# Altium schematic sheet Y9A_4_5050.SchDoc
size A4
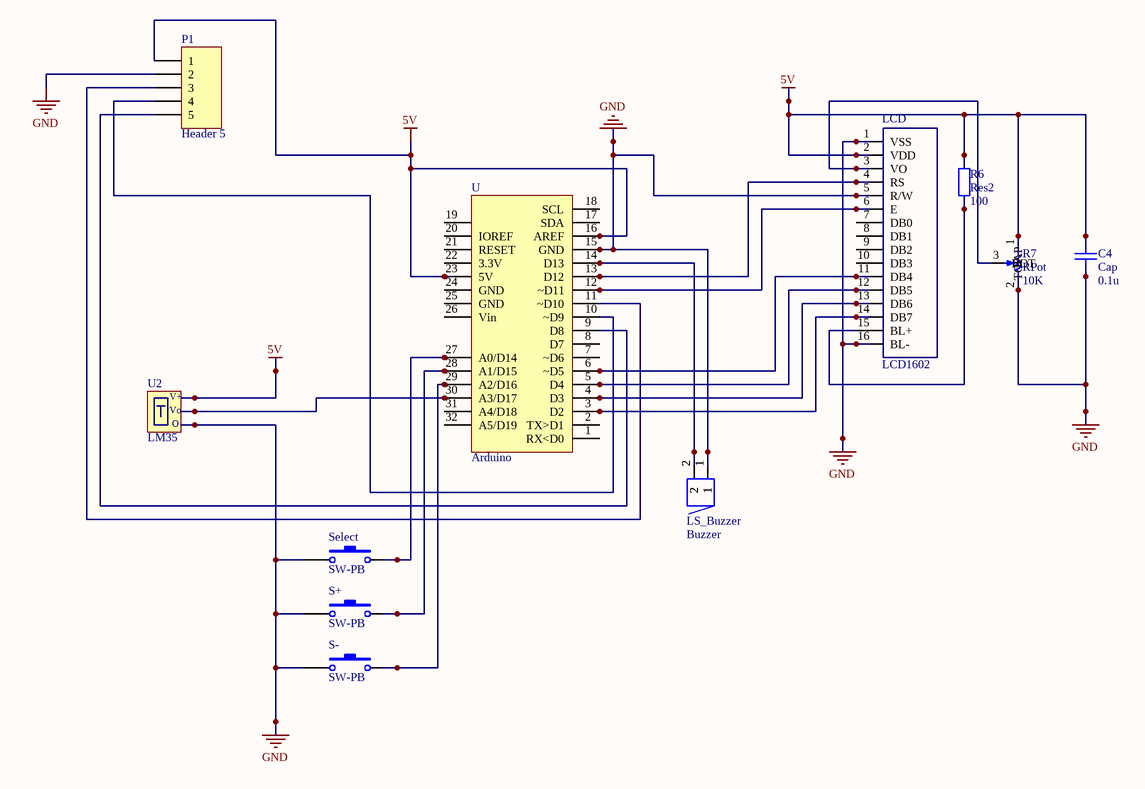
[diagram p0: Y9A_4_5050.SchDoc]

## Parts
C4  Cap  value 0.1u  [RAD-0.3]
LCD  LCD1602  [LCD1602]
LS_Buzzer  Buzzer  [Buzzer]
P1  Header 5  [HDR1X5]
R6  Res2  value 100  [AXIAL-0.4]
R7  RPot  value 10K  [RP-W]
S+  SW-PB  [AN-S]
S-  SW-PB  [AN-S]
Select  SW-PB  [AN-S]
U  Arduino  [Arduino-UNO-EX]
U2  LM35  [LM35]

## Nets
5V: C4.2 LCD.2(VDD) P1.1 R6.2 R7.1(TOP) U.16(AREF) U.23(5V) U2.1
GND: C4.1 LCD.1(VSS) LCD.5(R/W) LCD.16(BL-) LS_Buzzer.1 P1.2 R7.2(TAP) S+.1 S-.1 Select.1 U.15(GND) U2.3
NetLCD_3: LCD.3(VO) R7.3(BOT)
NetLCD_4: LCD.4(RS) U.13(D12)
NetLCD_6: LCD.6(E) U.12(~D11)
NetLCD_11: LCD.11(DB4) U.6(~D5)
NetLCD_12: LCD.12(DB5) U.5(D4)
NetLCD_13: LCD.13(DB6) U.4(D3)
NetLCD_14: LCD.14(DB7) U.3(D2)
NetLCD_15: LCD.15(BL+) R6.1
NetLS_Buzzer_2: LS_Buzzer.2 U.14(D13)
NetP1_3: P1.3 U.11(~D10)
NetP1_4: P1.4 U.10(~D9)
NetP1_5: P1.5 U.9(D8)
NetS+_2: S+.2 U.28(A1/D15)
NetS-_2: S-.2 U.29(A2/D16)
NetSelect_2: Select.2 U.27(A0/D14)
NetU_30: U.30(A3/D17) U2.2

Not connected (* = marked no-connect by the designer): LCD 7(DB0) 8(DB1) 9(DB2) 10(DB3); U 1(RX<D0) 2(TX>D1) 7(~D6) 8(D7) 17(SDA) 18(SCL) 19 20(IOREF) 21(RESET) 22(3.3V) 24(GND) 25(GND) 26(Vin) 31(A4/D18) 32(A5/D19)

## Notes on the sheet
- (in symbol LM35) V+; Vo; O

## Library data of the parts
C4 = Cap: Capacitor; Published: 8-Jun-2000; LatestRevisionDate: 17-Jul-2002; LatestRevisionNote: Re-released for DXP Platform.; PackageReference: RAD-0.3; Publisher: Altium Limited
LS_Buzzer = Buzzer: Magnetic Transducer Buzzer; Published: 24-Mar-1999; LatestRevisionDate: 17-Dec-2003; LatestRevisionNote: Schematic revised, PCB Footprint replaced.; DatasheetDocument: 17-Dec-2003; PackageReference: ABSM-1574; Publisher: Altium Limited; ComponentLink1Description: Manufacturer Link; ComponentLink1URL: http://www.megastar.com/linecard/buzzmode/index.php
P1 = Header 5: Header, 5-Pin; LatestRevisionDate: 17-Jul-2002; LatestRevisionNote: Re-released for DXP Platform.; Publisher: Altium Limited
R6 = Res2: Resistor; Published: 8-Jun-2000; LatestRevisionDate: 17-Jul-2002; LatestRevisionNote: Re-released for DXP Platform.; PackageReference: AXIAL-0.4; Publisher: Altium Limited
R7 = RPot: Potentiometer; Sim Note: Enter the Resistance value and the set point into parameter fields.; Set Position: 0.5; Published: 8-Jun-2000; LatestRevisionDate: 17-Jul-2002; LatestRevisionNote: Re-released for DXP Platform.; PackageReference: VR5; Publisher: Altium Limited
S+ S- Select = SW-PB: Switch; Published: 24-Mar-1999; LatestRevisionDate: 17-Jul-2002; LatestRevisionNote: Re-released for DXP Platform.; PackageReference: SPST-2; Publisher: Altium Limited
U = Arduino-UNO-EX
U2 = LM35: LM35温度传感器